# EAGLE schematic FC_Schematic (EAGLE 8.6.0)
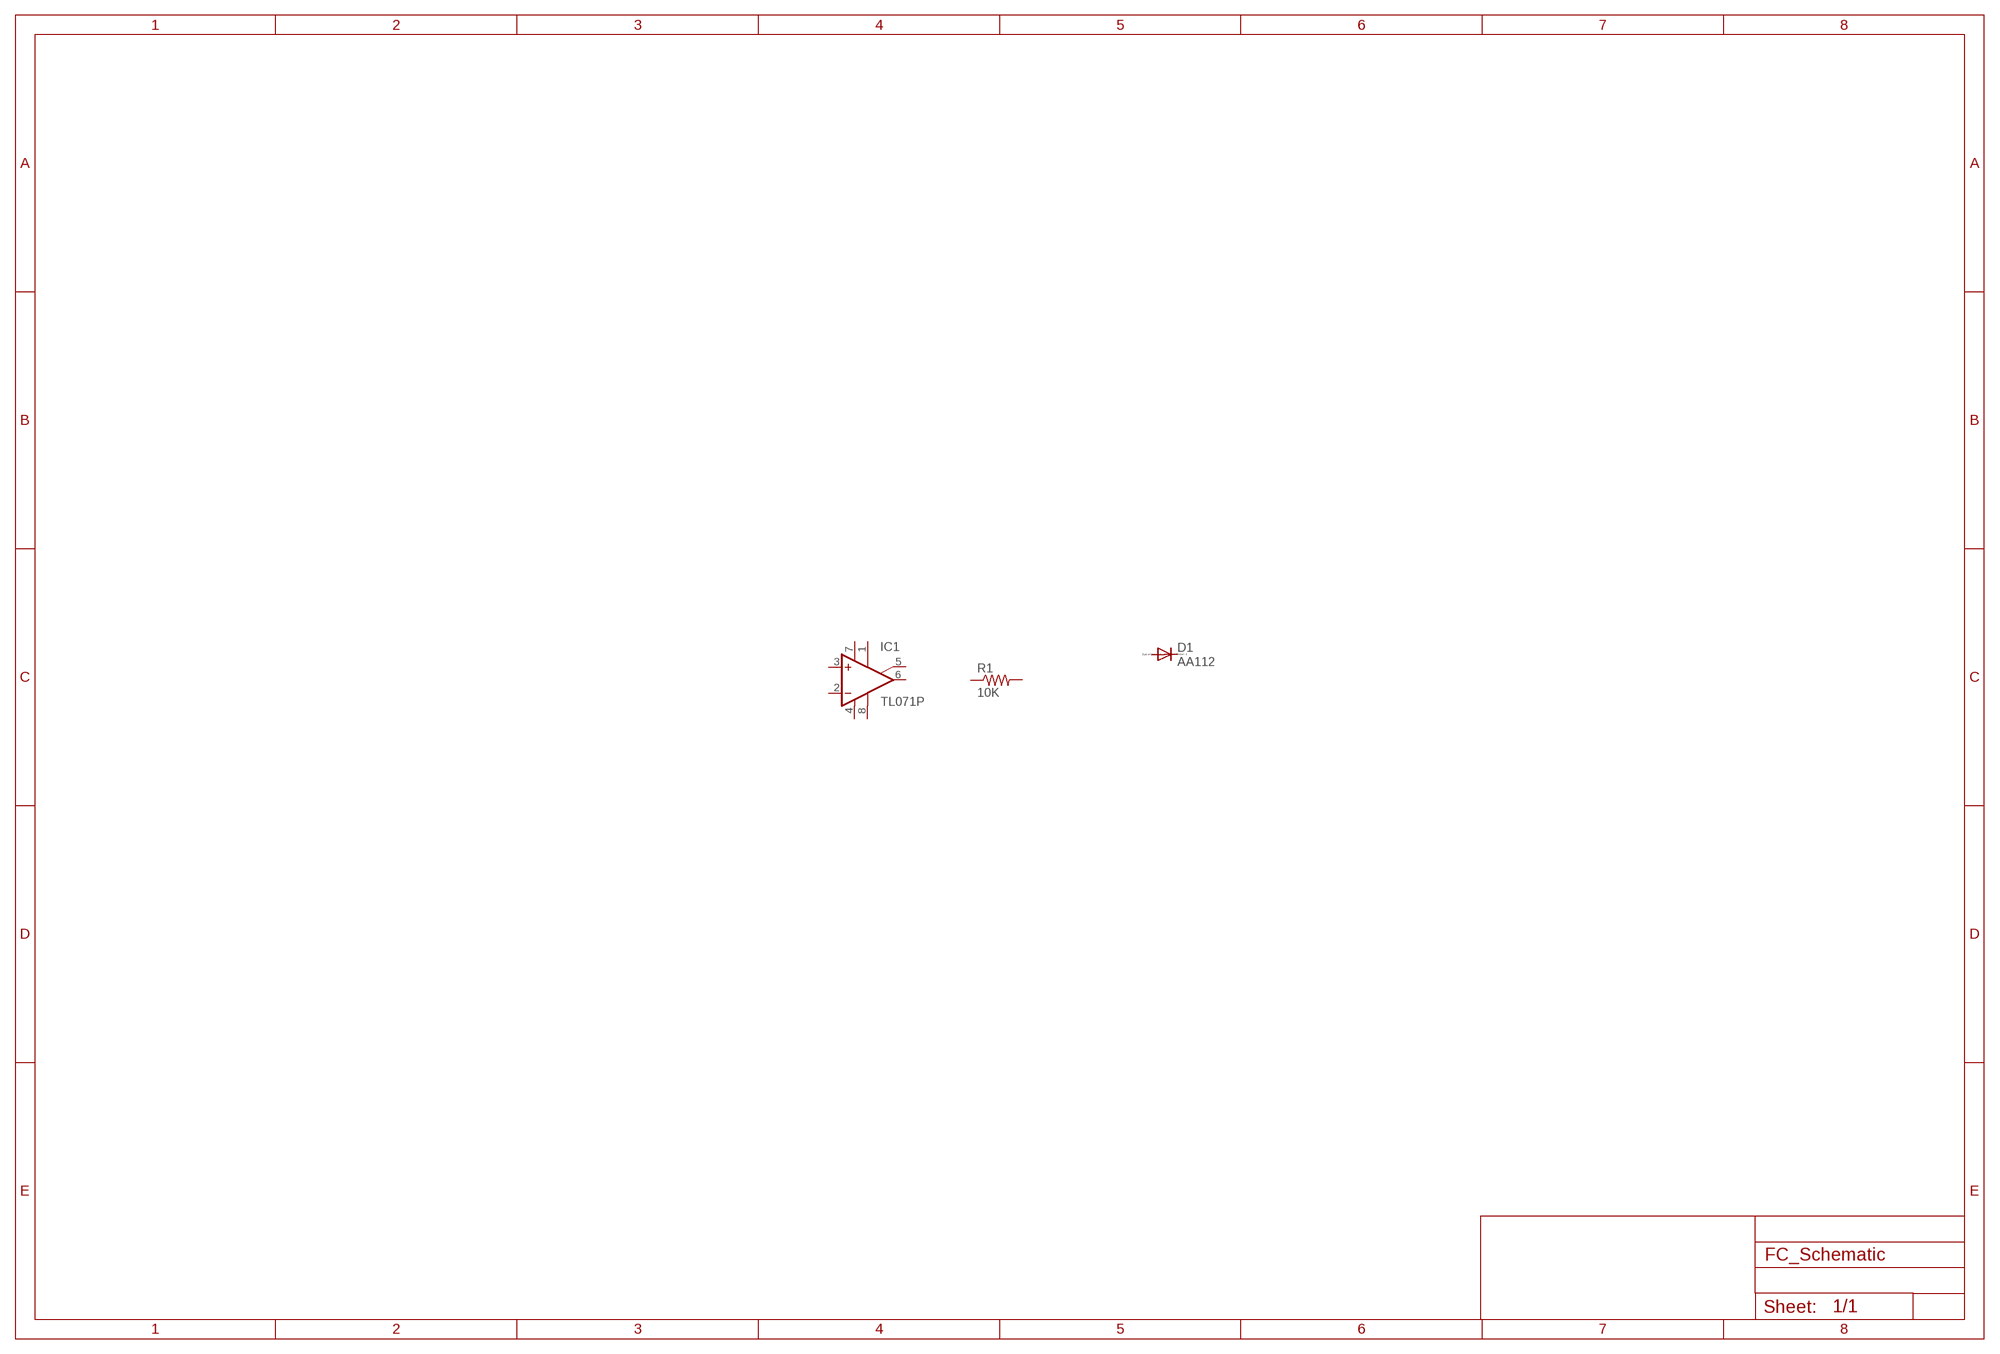
[diagram p0: schematic, sheet 1]

## Parts
D1  AA112  [DO07]
IC1  TL071P  [DIL08]
R1  10K  R-US_0207/10  [0207/10]
Unconnected: D1.A D1.C IC1.1(ON1) IC1.2(-IN) IC1.3(+IN) IC1.5(ON2) IC1.6(OUT) IC1.8(OPT) R1.1 R1.2

## Power pins joined to a net without a drawn wire
V+: IC1.7(V+)
V-: IC1.4(V-)

## Library data of the parts
D1 = diode:AA112: DIODE germanium
IC1 = linear:TL071: OP AMP
R1 = rcl:R-US_: RESISTOR, American symbol; SPICEPREFIX: R